# Altium project master.PrjPcb (part 2 of 2)

## Sheet mcu1_secondary.SchDoc: foxBMS BMS-Master
size A3; DocumentNumber: 11; SheetNumber: 11; SheetTotal: 24; Author: Fraunhofer IISB foxBMS Team; REL-DATE: 2017-05-16; VERSION: 1.0.2; SheetDescription: MCU1 (Secondary)
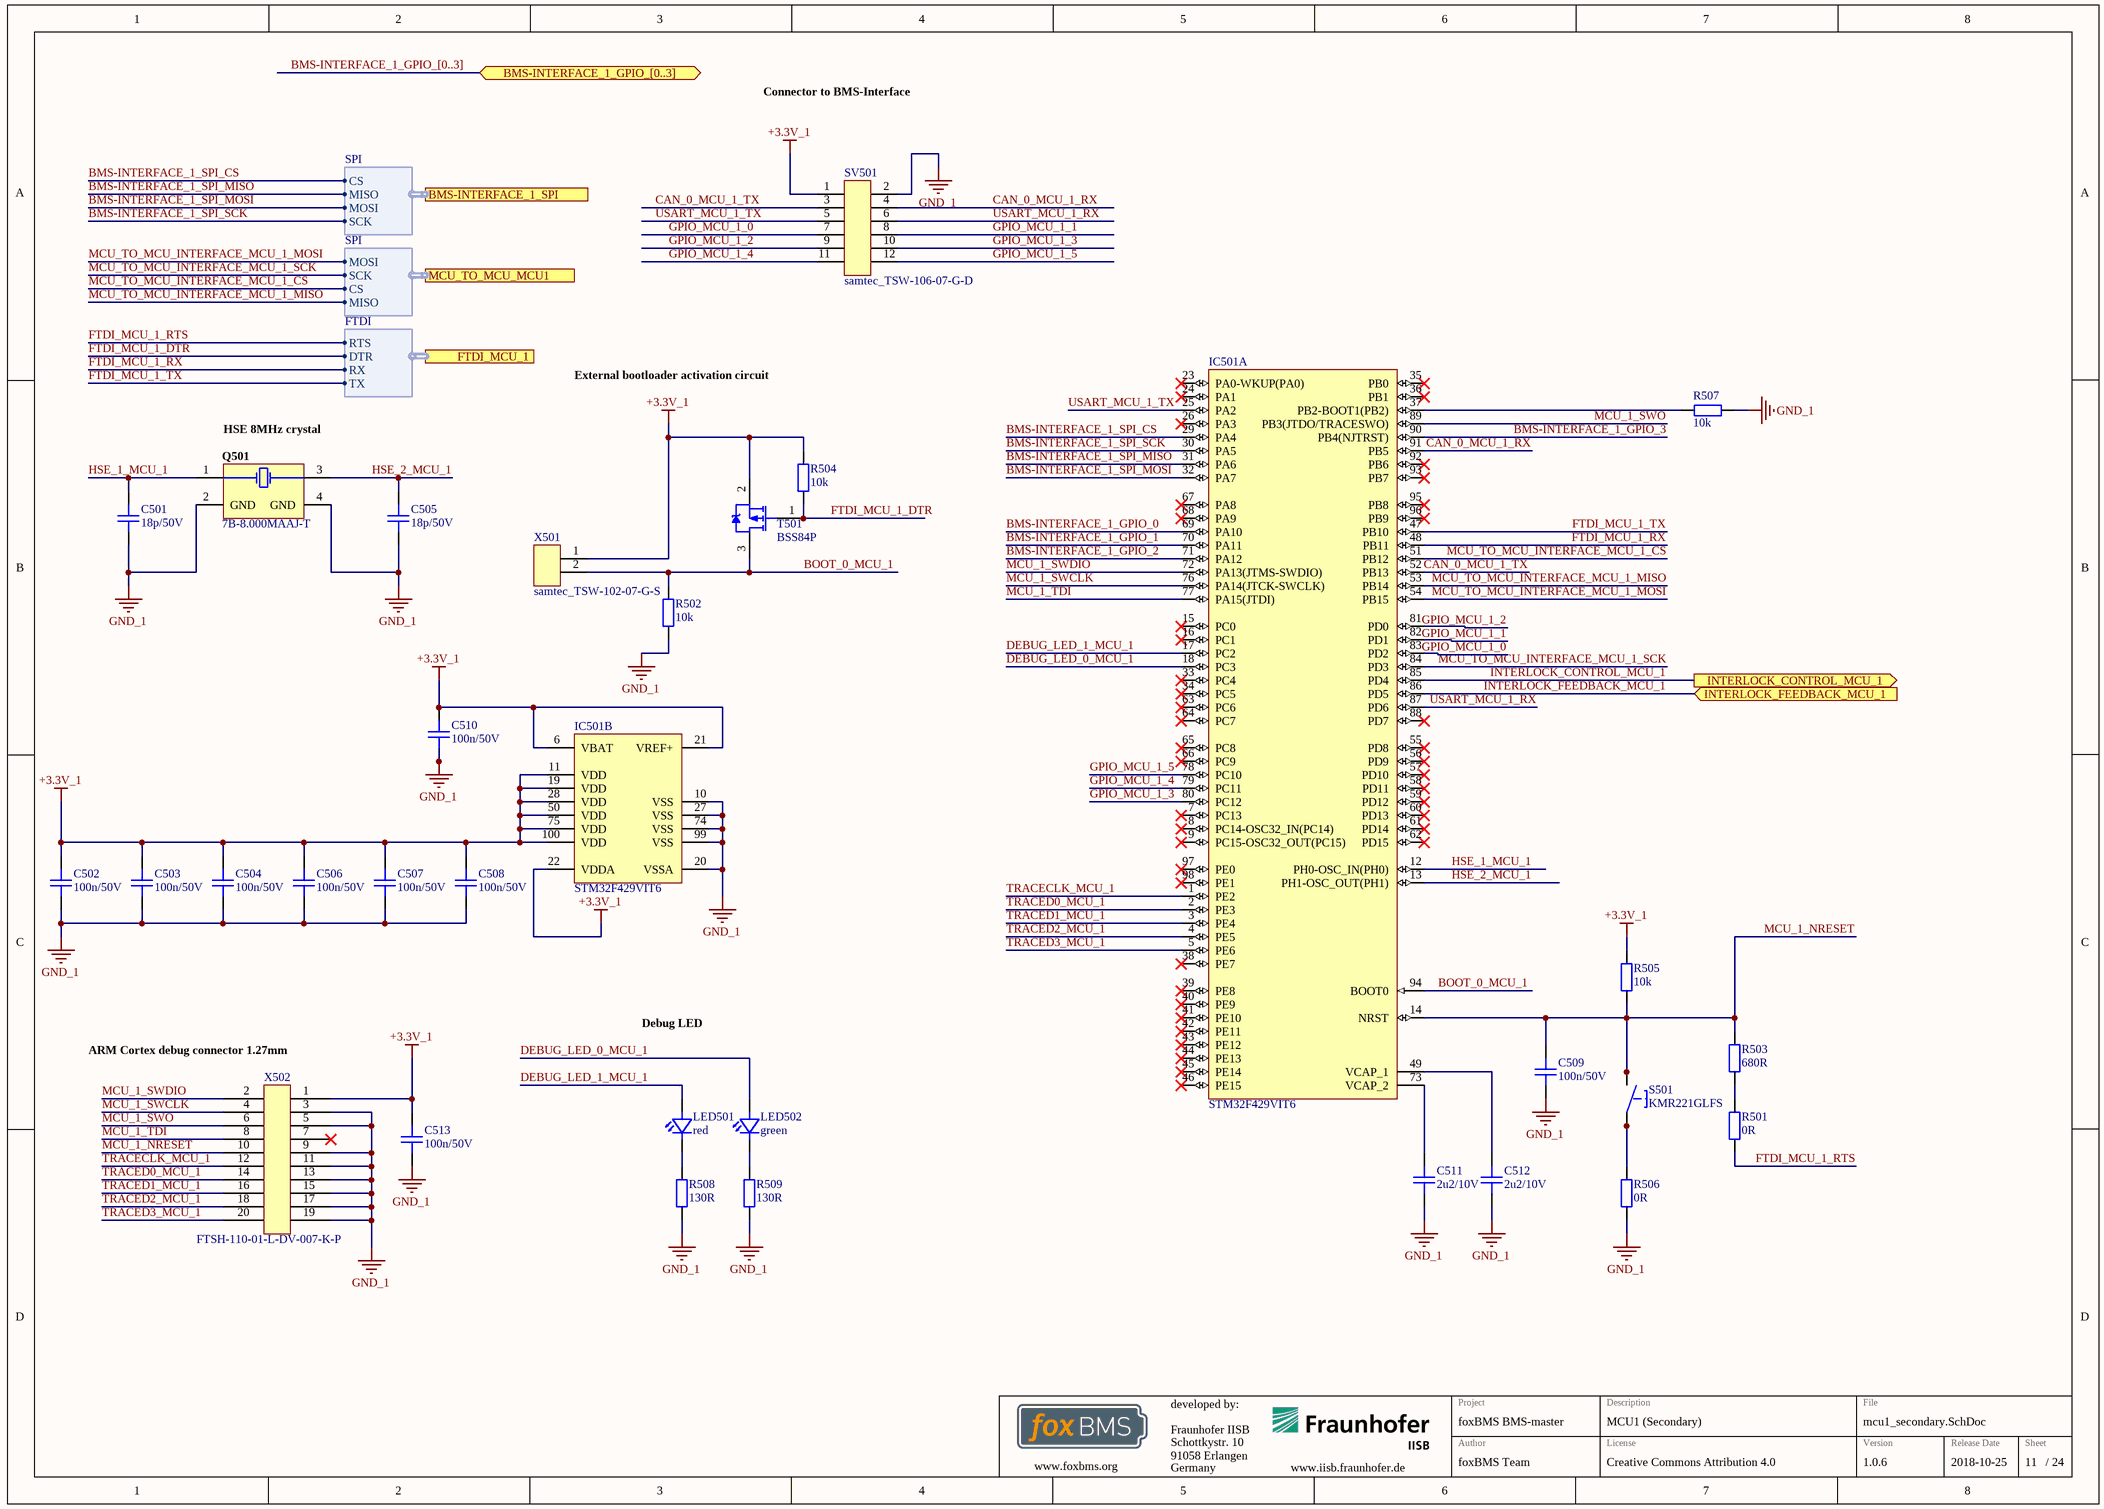
[diagram p4: mcu1_secondary.SchDoc]

### Parts
C501  18p/50V  [CAPC1608X08N]
C502  100n/50V  [CAPC1608X08N]
C503  100n/50V  [CAPC1608X08N]
C504  100n/50V  [CAPC1608X08N]
C505  18p/50V  [CAPC1608X08N]
C506  100n/50V  [CAPC1608X08N]
C507  100n/50V  [CAPC1608X08N]
C508  100n/50V  [CAPC1608X08N]
C509  100n/50V  [CAPC1608X08N]
C510  100n/50V  [CAPC1608X08N]
C511  2u2/10V  [CAPC1608X08N]
C512  2u2/10V  [CAPC1608X08N]
C513  100n/50V  [CAPC1608X08N]
IC501  STM32F429VIT6  [STM-LQFP100_N]  (parts A,B of 2)
LED501  red  [LEDC1608X07N]
LED502  green  [LEDC1608X07N]
Q501  7B-8.000MAAJ-T  [TXC-7B-4_V]
R501  0R  [RESC1608X05N]
R502  10k  [RESC1608X05N]
R503  680R  [RESC1608X05N]
R504  10k  [RESC1608X05N]
R505  10k  [RESC1608X05N]
R506  0R  [RESC1608X05N]
R507  10k  [RESC1608X05N]
R508  130R  [RESC1608X05N]
R509  130R  [RESC1608X05N]
S501  KMR221GLFS  [KMR2_Series]
SV501  samtec_TSW-106-07-G-D  [Pinheader_2.54_2x6]
T501  BSS84P  [INF-PG-SOT23_N]
X501  samtec_TSW-102-07-G-S  [Pinheader_2.54_2]
X502  FTSH-110-01-L-DV-007-K-P  [CORTEX_DEBUG_20_PIN]

### Ports
BMS-INTERFACE_1_GPIO_[0..3] (bidir), BMS-INTERFACE_1_SPI (harness SPI), FTDI_MCU_1 (harness FTDI), INTERLOCK_CONTROL_MCU_1 (out), INTERLOCK_FEEDBACK_MCU_1 (in), MCU_TO_MCU_MCU1 (harness SPI)

### Harnesses
SPI: CS, MISO, MOSI, SCK
FTDI: RTS, DTR, RX, TX

### Nets
+3.3V_1: C502.1 C503.1 C504.1 C506.1 C507.1 C508.1 C510.1 C513.1 IC501.6(VBAT) IC501.11(VDD) IC501.19(VDD) IC501.21(VREF+) IC501.22(VDDA) IC501.28(VDD) IC501.50(VDD) IC501.75(VDD) IC501.100(VDD) R504.2 R505.2 SV501.1 T501.2(SOURCE) X501.1 X502.1
GND_1: C501.1 C502.2 C503.2 C504.2 C505.2 C506.2 C507.2 C508.2 C509.2 C510.2 C511.2 C512.2 C513.2 IC501.10(VSS) IC501.20(VSSA) IC501.27(VSS) IC501.74(VSS) IC501.99(VSS) Q501.2(GND) Q501.4(GND) R502.1 R506.1 R507.1 R508.1 R509.1 SV501.2 X502.3 X502.5 X502.9 X502.11 X502.13 X502.15 X502.17 X502.19
BMS-INTERFACE_1_GPIO_0: IC501.69(PA10)
BMS-INTERFACE_1_GPIO_1: IC501.70(PA11)
BMS-INTERFACE_1_GPIO_2: IC501.71(PA12)
BMS-INTERFACE_1_GPIO_3: IC501.90(PB4(NJTRST))
BMS-INTERFACE_1_SPI_CS: IC501.29(PA4) ; port BMS-INTERFACE_1_SPI.CS
BMS-INTERFACE_1_SPI_MISO: IC501.31(PA6) ; port BMS-INTERFACE_1_SPI.MISO
BMS-INTERFACE_1_SPI_MOSI: IC501.32(PA7) ; port BMS-INTERFACE_1_SPI.MOSI
BMS-INTERFACE_1_SPI_SCK: IC501.30(PA5) ; port BMS-INTERFACE_1_SPI.SCK
BOOT_0_MCU_1: IC501.94(BOOT0) R502.2 T501.3(DRAIN) X501.2
CAN_0_MCU_1_RX: IC501.91(PB5) SV501.4
CAN_0_MCU_1_TX: IC501.52(PB13) SV501.3
DEBUG_LED_0_MCU_1: IC501.18(PC3) LED502.2(A)
DEBUG_LED_1_MCU_1: IC501.17(PC2) LED501.2(A)
FTDI_MCU_1_DTR: R504.1 T501.1(GATE) ; port FTDI_MCU_1.DTR
FTDI_MCU_1_RTS: R501.2 ; port FTDI_MCU_1.RTS
FTDI_MCU_1_RX: IC501.48(PB11) ; port FTDI_MCU_1.RX
FTDI_MCU_1_TX: IC501.47(PB10) ; port FTDI_MCU_1.TX
GPIO_MCU_1_0: IC501.83(PD2) SV501.7
GPIO_MCU_1_1: IC501.82(PD1) SV501.8
GPIO_MCU_1_2: IC501.81(PD0) SV501.9
GPIO_MCU_1_3: IC501.80(PC12) SV501.10
GPIO_MCU_1_4: IC501.79(PC11) SV501.11
GPIO_MCU_1_5: IC501.78(PC10) SV501.12
HSE_1_MCU_1: C501.2 IC501.12(PH0-OSC_IN(PH0)) Q501.1(X1)
HSE_2_MCU_1: C505.1 IC501.13(PH1-OSC_OUT(PH1)) Q501.3(X2)
INTERLOCK_CONTROL_MCU_1: IC501.85(PD4) ; port INTERLOCK_CONTROL_MCU_1
INTERLOCK_FEEDBACK_MCU_1: IC501.86(PD5) ; port INTERLOCK_FEEDBACK_MCU_1
MCU_1_NRESET: C509.1 IC501.14(NRST) R503.1 R505.1 S501.3 S501.4 X502.10
MCU_1_SWCLK: IC501.76(PA14(JTCK-SWCLK)) X502.4
MCU_1_SWDIO: IC501.72(PA13(JTMS-SWDIO)) X502.2
MCU_1_SWO: IC501.89(PB3(JTDO/TRACESWO)) X502.6
MCU_1_TDI: IC501.77(PA15(JTDI)) X502.8
MCU_TO_MCU_INTERFACE_MCU_1_CS: IC501.51(PB12) ; port MCU_TO_MCU_MCU1.CS
MCU_TO_MCU_INTERFACE_MCU_1_MISO: IC501.53(PB14) ; port MCU_TO_MCU_MCU1.MISO
MCU_TO_MCU_INTERFACE_MCU_1_MOSI: IC501.54(PB15) ; port MCU_TO_MCU_MCU1.MOSI
MCU_TO_MCU_INTERFACE_MCU_1_SCK: IC501.84(PD3) ; port MCU_TO_MCU_MCU1.SCK
TRACECLK_MCU_1: IC501.1(PE2) X502.12
TRACED0_MCU_1: IC501.2(PE3) X502.14
TRACED1_MCU_1: IC501.3(PE4) X502.16
TRACED2_MCU_1: IC501.4(PE5) X502.18
TRACED3_MCU_1: IC501.5(PE6) X502.20
USART_MCU_1_RX: IC501.87(PD6) SV501.6
USART_MCU_1_TX: IC501.25(PA2) SV501.5
NetC511_1: C511.1 IC501.73(VCAP_2)
NetC512_1: C512.1 IC501.49(VCAP_1)
NetIC501_37: IC501.37(PB2-BOOT1(PB2)) R507.2
NetLED501_1: LED501.1(C) R508.2
NetLED502_1: LED502.1(C) R509.2
NetR501_1: R501.1 R503.2
NetR506_2: R506.2 S501.1 S501.2

Not connected (* = marked no-connect by the designer): IC501 7(PC13)* 8(PC14-OSC32_IN(PC14))* 9(PC15-OSC32_OUT(PC15))* 15(PC0)* 16(PC1)* 23(PA0-WKUP(PA0))* 24(PA1)* 26(PA3)* 33(PC4)* 34(PC5)* 35(PB0)* 36(PB1)* 38(PE7)* 39(PE8)* 40(PE9)* 41(PE10)* 42(PE11)* 43(PE12)* 44(PE13)* 45(PE14)* 46(PE15)* 55(PD8)* 56(PD9)* 57(PD10)* 58(PD11)* 59(PD12)* 60(PD13)* 61(PD14)* 62(PD15)* 63(PC6)* 64(PC7)* 65(PC8)* 66(PC9)* 67(PA8)* 68(PA9)* 88(PD7)* 92(PB6)* 93(PB7)* 95(PB8)* 96(PB9)* 97(PE0)* 98(PE1)*; X502 7*

### Buses and harness runs
bus BMS-INTERFACE_1_GPIO_[0..3] = port BMS-INTERFACE_1_GPIO_[0..3]

### Notes on the sheet
- Connector to BMS-Interface
- External bootloader activation circuit
- (near Q501) HSE 8MHz crystal
- (near X502) ARM Cortex debug connector 1.27mm
- Debug LED
- Fraunhofer IISB
- Schottkystr. 10
- developed by:
- 91058 Erlangen
- Germany
- Author
- Project
- License
- Description
- File
- Version
- Release Date
- Sheet
- www.foxbms.org
- www.iisb.fraunhofer.de
- foxBMS Team
- /

### Library data of the parts
C501 C505 = gen_C_ceramic_18p_50V_C0G_0603: MLCC; Capacitance: 18p; Rated Voltage: 50V; Dielectric: C0G; Case EIA: 0603; Case Metric: 1608; Automotive Qualified: False; Part Number: gen_C_ceramic_18p_50V_C0G_0603; Supplier 1: Farnell; Supplier Part Number 1: 2070403
C502-C504 C506-C510 C513 = gen_C_ceramic_100n_50V_X7R_0603: MLCC; Capacitance: 100n; Rated Voltage: 50V; Dielectric: X7R; Case EIA: 0603; Case Metric: 1608; PnP Package: C_0603_10; PnP Value: 100n/50V/X7R; PnP equipped: x; Automotive Qualified: False; Part Number: gen_C_ceramic_100n_50V_X7R_0603; Supplier 1: Farnell; Supplier Part Number 1: 2525267; Supplier 2: Digikey; Supplier Part Number 2: 490-6049-1-ND
C511 C512 = gen_C_ceramic_2u2_10V_X5R_0603: MLCC; Capacitance: 2u2; Rated Voltage: 10V; Dielectric: X5R; Case EIA: 0603; Case Metric: 1608; AVT Set: x; Automotive Qualified: False; Part Number: gen_C_ceramic_2u2_10V_X5R_0603; Supplier 1: Farnell; Supplier Part Number 1: 2320817
IC501 = CMP-0243-00030-2: ARM Cortex-M4 32-bit MCU+FPU, 225 DMIPS, 2048 kB Flash, 256 kB Internal RAM, 82 I/Os, 100-pin LQFP, -40 to 85 degC, Tray; Manufacturer: STMicroelectronics; FLASH Size (Prog) (kB): 2048; Supply Voltage(Vcc) min (V): 1.8; Operating Frequency(F) (Processor speed) (MHz): 180; Supply Voltage(Vcc) max (V): 3.6; D/A Converter: 2x12-bit; Internal RAM Size (kB): 256; I/Os (High Current): 82; Mounting Technology: Surface Mount; ComponentLink3URL: http://www.st.com/st-web-ui/static/active/en/resource/technical/document/data_brief/DM00071938.pdf; ComponentLink2URL: http://www.st.com/st-web-ui/static/active/en/resource/technical/document/data_brief/DM00053488.pdf; ComponentLink3Description: Package Specification; Packing: Tray; PackageDescription: 100-Pin Low Profile Quad Flat Package, 14 x 14 mm Body, 0.5 mm Pitch; PartNumber: STM32F429VIT6; ComponentLink2Description: Datasheet; ComponentLink1Description: Manufacturer URL; ComponentLink1URL: http://www.st.com/web/en/home.html; DatasheetVersion: Rev. 2; Core: ARM Cortex-M4; PackageReference: LQFP100; PackageVersion: Rev. 1, 06/2013
LED501 = gen_LED_0603_red: LED; Breakdown Voltage: 5V; Continuous Forward Current: 20mA; Forward Voltage @ 20mA: 2V; Automotive Qualified: False; Part Number: gen_LED_0603_red; Color: red; PnP Package: LED_0603; Supplier 1: Farnell; Supplier Part Number 1: 2099221
LED502 = gen_LED_0603_green: LED; Breakdown Voltage: 5V; Continuous Forward Current: 20mA; Forward Voltage @ 20mA: 2.2V; Automotive Qualified: False; Part Number: gen_LED_0603_green; Color: green; PnP Package: LED_0603; Supplier 1: Farnell; Supplier Part Number 1: 2099223
Q501 = CMP-1774-00004-1: SMD Seam Sealing Crystal, 8 MHz, +/- 30 ppm, 18 pF, -10 to 70 degC, 4-Pin SMD, RoHS, Tape and Reel; Power Rating: 100 mW; Case\Package: 0603; Voltage Rating: 50 V; Tolerance: 1%; Resistance: 150 Ohm; Package Quantity: 5000; Case Code (Metric): 1608; Packaging: Tape and Reel; Length: 1.6 mm; RoHSCompliant: true; REACH SVHC: No SVHC; Mount: Surface Mount; Case Code (Imperial): 0603; Pins: 2; Width: 0.8 mm; PackageDescription: 4-Pin Surface Mount Device, Body 5 x 3.2 mm, Pitch 3.7 mm; ComponentLink1Description: Datasheet; DatasheetVersion: Jul-15; ComponentLink1URL: http://www.txccorp.com/download/products/quartz_crystals/2015TXC_7B_19.pdf; PackageReference: 7B-4; Height: 0.45 mm; Max Operating Temperature: 155 degC; Min Operating Temperature: -55 degC; Voltage Rating (DC): 50 V
R501 R506 = gen_R_0R_0603: SMD Resistor 0R 0603; Power: 0.1W; Case EIA: 0603; Case Metric: 1608; PnP Package: R_0603; Maximum Working Voltage: 75V; Automotive Qualified: False; Part Number: gen_R_0R_0603; Operating Temperature: -55°C - +155°C; Resistance: 0R; Series: Jumper; PnP Value: 0R; Supplier 1: Farnell; Supplier Part Number 1: 2073345
R502 R504 R505 R507 = gen_R_10k_0603: SMD Resistor 10k 0603; Tolerance: 1%; Power: 0.1W; Case EIA: 0603; Case Metric: 1608; Maximum Working Voltage: 75V; PnP Package: R_0603; Automotive Qualified: False; Part Number: gen_R_10k_0603; Operating Temperature: -55°C - +155°C; Resistance: 10k; Series: E24, E96; PnP Value: 10k; Supplier 1: Farnell; Supplier Part Number 1: 2073349
R503 = gen_R_680R_0603: SMD Resistor 680R 0603; Tolerance: 1%; Power: 0.1W; Case EIA: 0603; Case Metric: 1608; Maximum Working Voltage: 75V; PnP Package: R_0603; Automotive Qualified: False; Part Number: gen_R_680R_0603; Operating Temperature: -55°C - +155°C; Resistance: 680R; Series: E24; PnP Value: 680R; Supplier 1: Farnell; Supplier Part Number 1: 2797303
R508 R509 = gen_R_130R_0603: SMD Resistor 130R 0603; Tolerance: 1%; Power: 0.1W; Case EIA: 0603; Case Metric: 1608; Maximum Working Voltage: 75V; PnP Package: R_0603; Automotive Qualified: False; Part Number: gen_R_130R_0603; Operating Temperature: -55°C - +155°C; Resistance: 130R; Series: E24, E96; PnP Value: 130R; Supplier 1: Farnell; Supplier Part Number 1: 2379959
S501 = KMR221GLFS: Microminiature Tactile Switch; Manufacturer: CK Components; Automotive Qualified: False; Part Number: KMR221GLFS; Operating Temperature: -40°C - +85°C; ComponentLink1Description: Datasheet; ComponentLink1URL: http://www.farnell.com/datasheets/1685525.pdf; Supplier 1: Farnell; Supplier Part Number 1: 1201424; Supplier 2: Digikey; Supplier Part Number 2: 401-1426-1-ND; Supplier 3: Mouser; Supplier Part Number 3: 611-KMR211G-LFS
SV501 = samtec_TSW-106-07-G-D: Board-To-Board Connector, Vertical, 2.54 mm, 12 Contacts, Header, TSW Series, Through Hole, 2 Rows; Manufacturer: Samtec; Circuits: 12; Rated Voltage: 500V AC mated with SSW; Automotive Qualified: False; Part Number: samtec_TSW-106-07-G-D; Part Name: TSW-106-07-G-D; Operating Temperature: -55°C - +125°C; ComponentLink1Description: Datasheet; ComponentLink1URL: http://www.farnell.com/datasheets/1992055.pdf?_ga=2.196729640.569325269.1503285096-1413671594.1503025027; Supplier 1: Farnell; Supplier Part Number 1: 2025252
T501 = CMP-1099-00028-1: P-Channel SIPMOS Small-Signal-Transistor, -60 V VDS, -0.17 A ID, -55 to 150 degC, PG-SOT23, Reel, Green; Manufacturer: Infineon; VGS(th) (max): -2Â V; VGS(th) (min): -1Â V; VDS (max): -60Â V; Rth: 350Â K/W; Pto t (max): 0.36Â W; ID (max): -0.17Â A; IDpuls (max): -0.68Â A; RDS (on) (max) (@4.5V): 12,000Â mOhm; QG: 1Â nC; Green: TRUE; RDS (on) (max): 8,000Â mOhm; ComponentLink3URL: http://www.infineon.com/dgdl/SOT23-Package_Overview.pdf?folderId=db3a30431936bc4b0119532290053c66&fileId=db3a30431936bc4b0119533468123c85; ComponentLink3Description: Package Specification; Packing: Reel; PartNumber: BSS84P; ComponentLink2Description: Datasheet; Mounting Technology: Surface Mount; ComponentLink2URL: http://www.infineon.com/dgdl/BSS84P_Rev2.7%5B1%5D.pdf?folderId=db3a304314dca38901154a72e3951a65&fileId=db3a304330f68606013118ac7a9b4549; PackageReference: PG-SOT23; ComponentLink1URL: http://www.infineon.com/; PackageVersion: Apr-08; ComponentLink1Description: Manufacturer URL; PackageDescription: 3-Pin Small Outline Transistor Package, 2.9 x 1.3 mm Body, 0.95 mm Pitch; Halogen-free: TRUE; DatasheetVersion: Rev. 2.7
X501 = samtec_TSW-102-07-G-S: Board-To-Board Connector, Vertical, 2.54 mm, 2 Contacts, Header, TSW Series, Through Hole, 1 Row; Manufacturer: Samtec; Circuits: 2; Automotive Qualified: False; Part Number: samtec_TSW-102-07-G-S; Part Name: TSW-102-07-G-S; Operating Temperature: -55°C - +125°C; ComponentLink1Description: Datasheet; ComponentLink1URL: http://www.farnell.com/datasheets/1796313.pdf; Supplier 1: Farnell; Supplier Part Number 1: 2505044
X502 = samtec_FTSH-110-01-L-DV-007-K-P: Board-To-Board Connector, ARM Cortex Debug Header 20 Pin; Manufacturer: Samtec; Circuits: 20; Automotive Qualified: False; Part Number: samtec_FTSH-110-01-L-DV-007-K-P; Part Name: FTSH-110-01-L-DV-007-K-P; Operating Temperature: -55°C - +125°C; Supplier 1: Digikey; Supplier Part Number 1: SAM11268-ND; Supplier 2: Avnet; Supplier Part Number 2: FTSH-110-01-L-DV-007-K-P

## Sheet contactor_control.SchDoc: foxBMS BMS-Master
size A3; DocumentNumber: 16; SheetNumber: 16; SheetTotal: 24; Author: Fraunhofer IISB foxBMS Team; REL-DATE: 2017-05-16; VERSION: 1.0.2; SheetDescription: Contactor Control
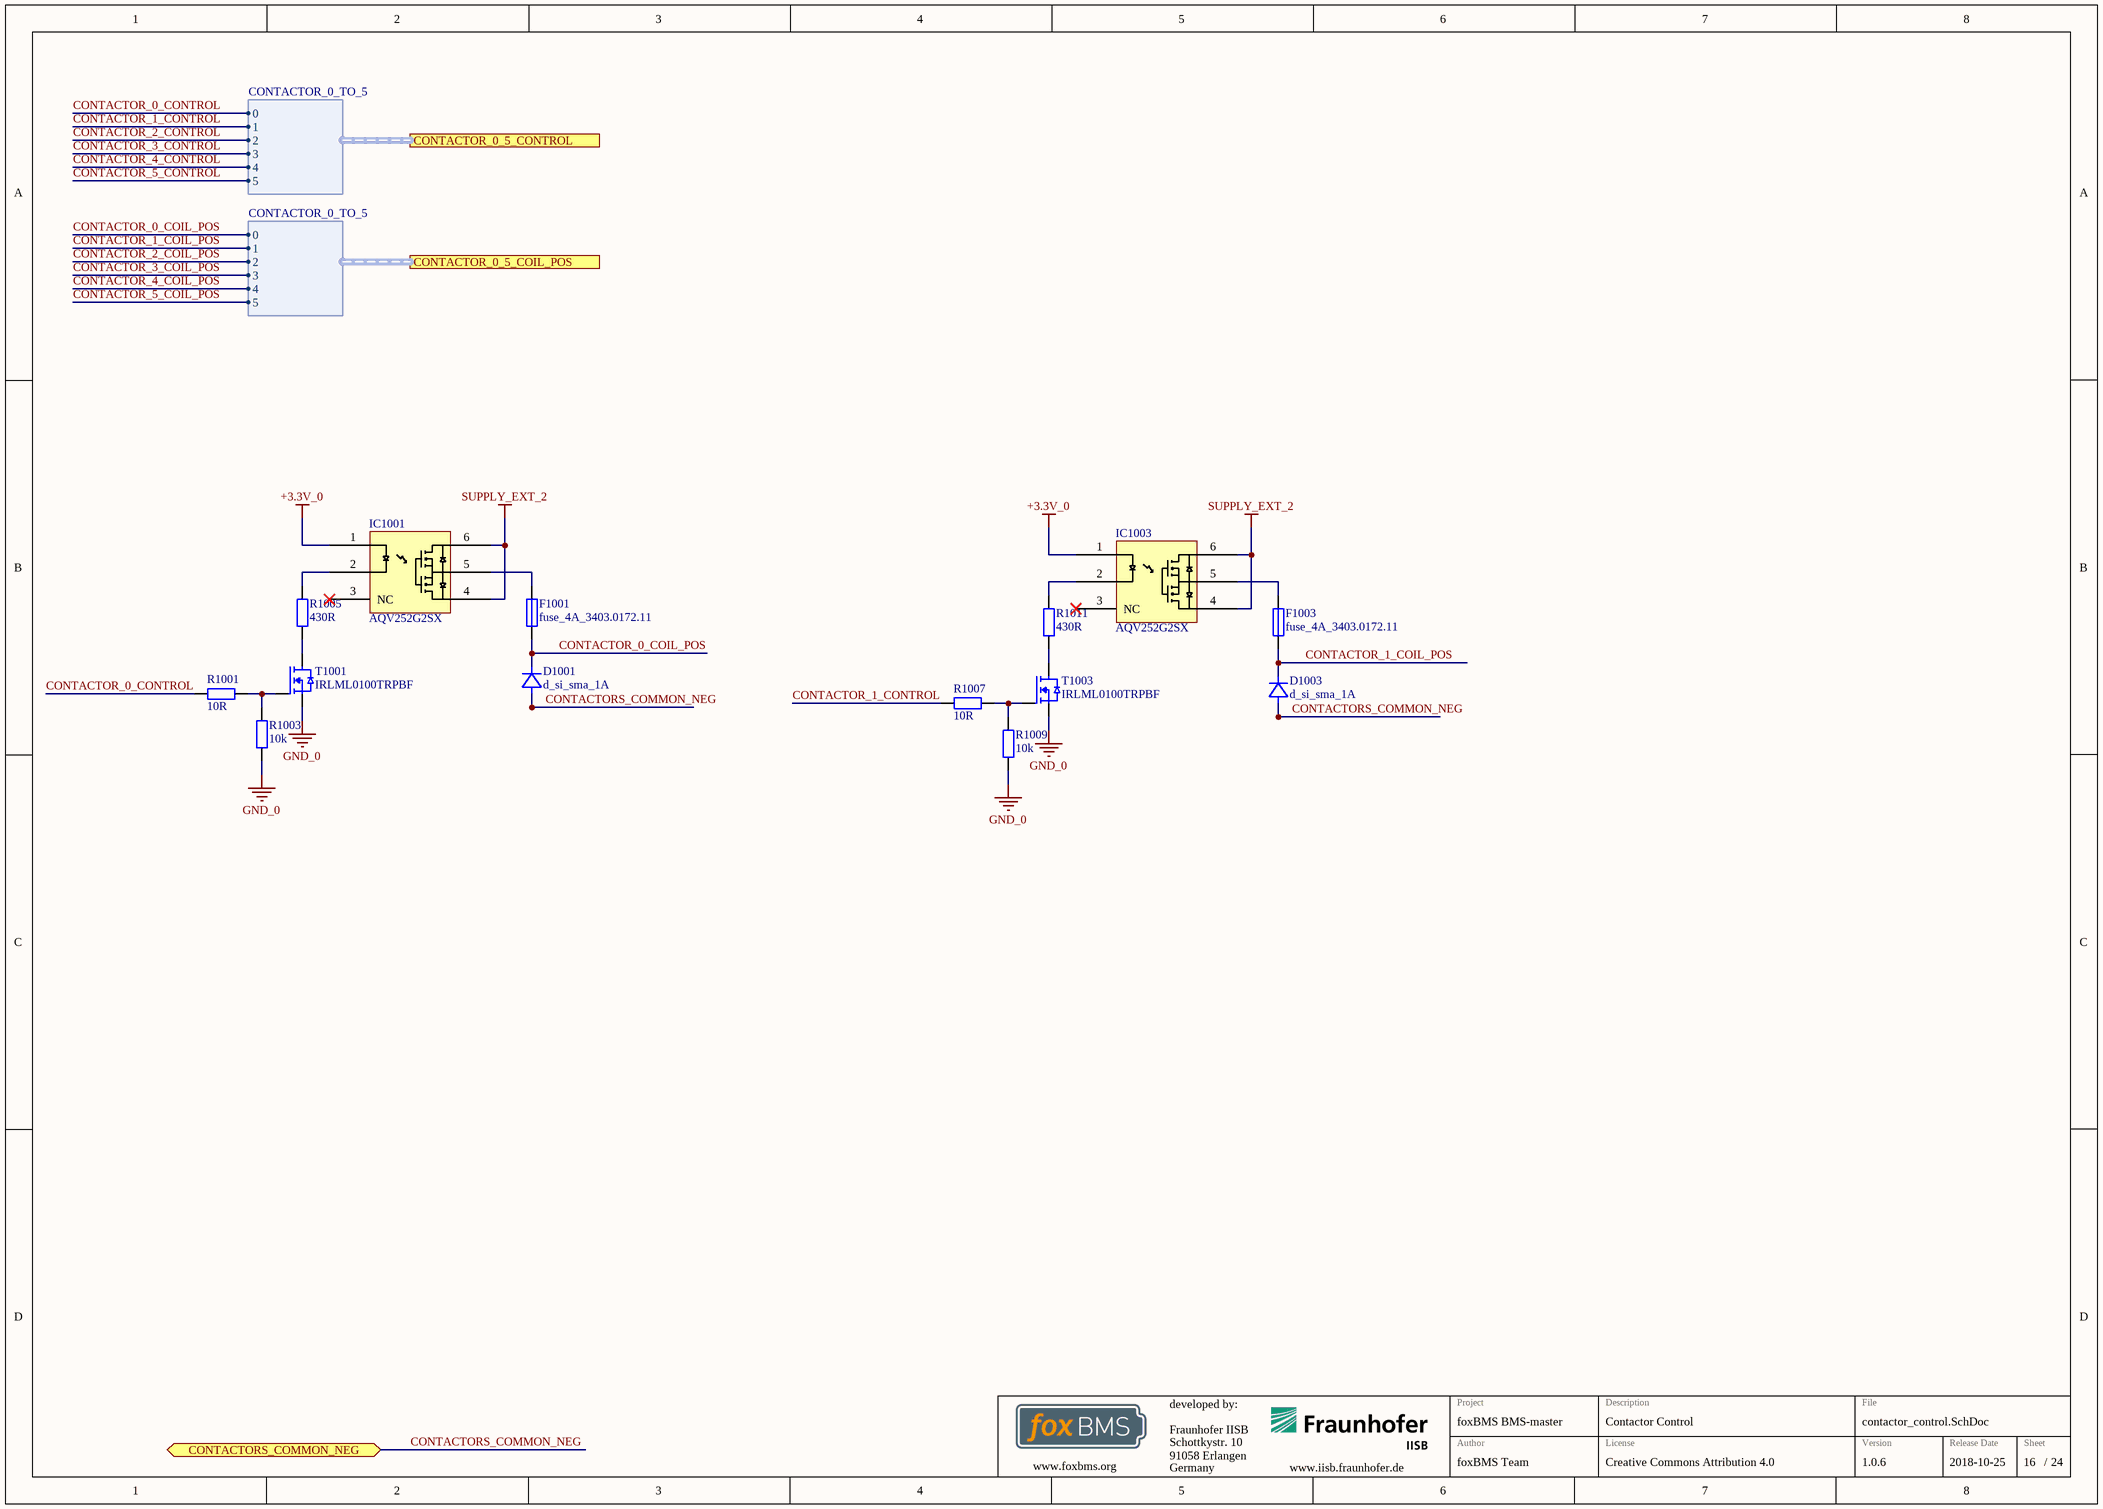
[diagram p5: contactor_control.SchDoc]

### Parts
D1001  d_si_sma_1A  [DIOM4326X24N]
D1003  d_si_sma_1A  [DIOM4326X24N]
F1001  fuse_4A_3403.0172.11  [Schurter_UMT_250]
F1003  fuse_4A_3403.0172.11  [Schurter_UMT_250]
IC1001  AQV252G2SX  [SOP254P680X220-6N]
IC1003  AQV252G2SX  [SOP254P680X220-6N]
R1001  10R  [RESC1608X05N]
R1003  10k  [RESC1608X05N]
R1005  430R  [RESC1608X05N]
R1007  10R  [RESC1608X05N]
R1009  10k  [RESC1608X05N]
R1011  430R  [RESC1608X05N]
T1001  IRLML0100TRPBF  [SOT95P237X110-3N]
T1003  IRLML0100TRPBF  [SOT95P237X110-3N]

### Ports
CONTACTOR_0_5_COIL_POS (harness CONTACTOR_0_TO_5), CONTACTOR_0_5_CONTROL (harness CONTACTOR_0_TO_5), CONTACTORS_COMMON_NEG (bidir)

### Harnesses
CONTACTOR_0_TO_5: 0, 1, 2, 3, 4, 5

### Nets
+3.3V_0: IC1001.1 IC1003.1
GND_0: R1003.1 R1009.1 T1001.S T1003.S
SUPPLY_EXT_2: IC1001.4 IC1001.6 IC1003.4 IC1003.6
CONTACTOR_0_COIL_POS: D1001.1(K) F1001.2 ; port CONTACTOR_0_5_COIL_POS.0
CONTACTOR_0_CONTROL: R1001.2 ; port CONTACTOR_0_5_CONTROL.0
CONTACTOR_1_COIL_POS: D1003.1(K) F1003.2 ; port CONTACTOR_0_5_COIL_POS.1
CONTACTOR_1_CONTROL: R1007.2 ; port CONTACTOR_0_5_CONTROL.1
CONTACTOR_2_COIL_POS: port CONTACTOR_0_5_COIL_POS.2
CONTACTOR_3_COIL_POS: port CONTACTOR_0_5_COIL_POS.3
CONTACTOR_4_COIL_POS: port CONTACTOR_0_5_COIL_POS.4
CONTACTOR_4_CONTROL: port CONTACTOR_0_5_CONTROL.4
CONTACTOR_5_COIL_POS: port CONTACTOR_0_5_COIL_POS.5
CONTACTORS_COMMON_NEG: D1001.2(A) D1003.2(A) ; port CONTACTORS_COMMON_NEG
NetF1001_1: F1001.1 IC1001.5
NetF1003_1: F1003.1 IC1003.5
NetIC1001_2: IC1001.2 R1005.2
NetIC1003_2: IC1003.2 R1011.2
NetR1001_1: R1001.1 R1003.2 T1001.G
NetR1005_1: R1005.1 T1001.D
NetR1007_1: R1007.1 R1009.2 T1003.G
NetR1011_1: R1011.1 T1003.D

Not connected (* = marked no-connect by the designer): IC1001 3(NC)*; IC1003 3(NC)*

### Notes on the sheet
- Fraunhofer IISB
- Schottkystr. 10
- developed by:
- 91058 Erlangen
- Germany
- Author
- Project
- License
- Description
- File
- Version
- Release Date
- Sheet
- www.foxbms.org
- www.iisb.fraunhofer.de
- foxBMS Team
- /

### Library data of the parts
D1001 D1003 = d_si_sma_1A: Standard Recovery Diode, 100 V, 1 A, Single, 1 V, 2 µs, 30 A; Part Name: GF1B; Manufacturer: ON Semiconductor; Breakdown Voltage: 100V; Continuous Forward Current: 1A; Automotive Qualified: False; Part Number: d_si_sma_1A; Operating Temperature: -65°C - +175°C; ComponentLink1Description: Datasheet; ComponentLink1URL: http://www.farnell.com/datasheets/2303965.pdf; Supplier 1: Farnell; Supplier Part Number 1: 1467477
F1001 F1003 = fuse_4A_3403.0172.11: Schurter SMD Fuse 4.0A UMT 3403.0172.11; Automotive Qualified: False; Part Number: fuse_4A_3403.0172.11; Manufacturer: Schurter; Operating Temperature: -55°C - +125°C; ComponentLink1Description: Catalog Page Digikey; ComponentLink1URL: http://dkc3.digikey.com/PDF/DE2011-DE/P2352.pdf; Supplier 1: Digikey; Supplier Part Number 1: 486-1253-ND; Supplier 2: Mouser; Supplier Part Number 2: 693-3403.0172.11
IC1001 IC1003 = AQV252G2SX: PhotoMOS Relay; Manufacturer: Panasonic; Automotive Qualified: False; Part Number: AQV252G2SX; Part Name: AQV252G2SX; Operating Temperature: -40°C - +85°C; Supplier 1: Digikey; Supplier Part Number 1: 255-3594-1-ND; Supplier 2: Farnell; Supplier Part Number 2: 2302216
R1001 R1007 = gen_R_10R_0603: SMD Resistor 10R 0603; Tolerance: 1%; Power: 0.1W; Case EIA: 0603; Case Metric: 1608; Maximum Working Voltage: 75V; PnP Package: R_0603; Automotive Qualified: False; Part Number: gen_R_10R_0603; Operating Temperature: -55°C - +155°C; Resistance: 10R; Series: E24, E96; PnP Value: 10R; Supplier 1: Farnell; Supplier Part Number 1: 2073361
R1003 R1009 = gen_R_10k_0603: as R502 on sheet mcu1_secondary; Part Number: gen_R_10k_0603; Operating Temperature: -55°C - +155°C; Resistance: 10k; Series: E24, E96; PnP Value: 10k; Supplier 1: Farnell; Supplier Part Number 1: 2073349
R1005 R1011 = gen_R_430R_0603: SMD Resistor 430R 0603; Tolerance: 1%; Power: 0.1W; Case EIA: 0603; Case Metric: 1608; Maximum Working Voltage: 75V; PnP Package: R_0603; Automotive Qualified: False; Part Number: gen_R_430R_0603; Operating Temperature: -55°C - +155°C; Resistance: 430R; Series: E24; PnP Value: 430R; Supplier 1: Farnell; Supplier Part Number 1: 2074259
T1001 T1003 = IRLML0100TRPBF: MOSFET-Transistor, n-Kanal, 1.6 A, 100 V, 0.178 ohm, 10 V, 2.5 V; Manufacturer: Infineon; Maximum Drain-Source Voltage: 100V; Maximum Continous Drain Current (25°C): 1.6A; R_DS(on): 190m; Total Gate Charge: 2.5nC; Automotive Qualified: False; Part Number: IRLML0100TRPBF; Part Name: NMOS; Operating Temperature: -55°C - +150°C; ComponentLink1Description: Datasheet URL; ComponentLink1URL: http://www.farnell.com/datasheets/491501.pdf; Supplier 1: Farnell; Supplier Part Number 1: 1783928

## Sheet contactor_feedback.SchDoc: foxBMS BMS-Master
size A3; DocumentNumber: 17; SheetNumber: 17; SheetTotal: 24; Author: Fraunhofer IISB foxBMS Team; REL-DATE: 2017-05-16; VERSION: 1.0.2; SheetDescription: Contactor Feedback
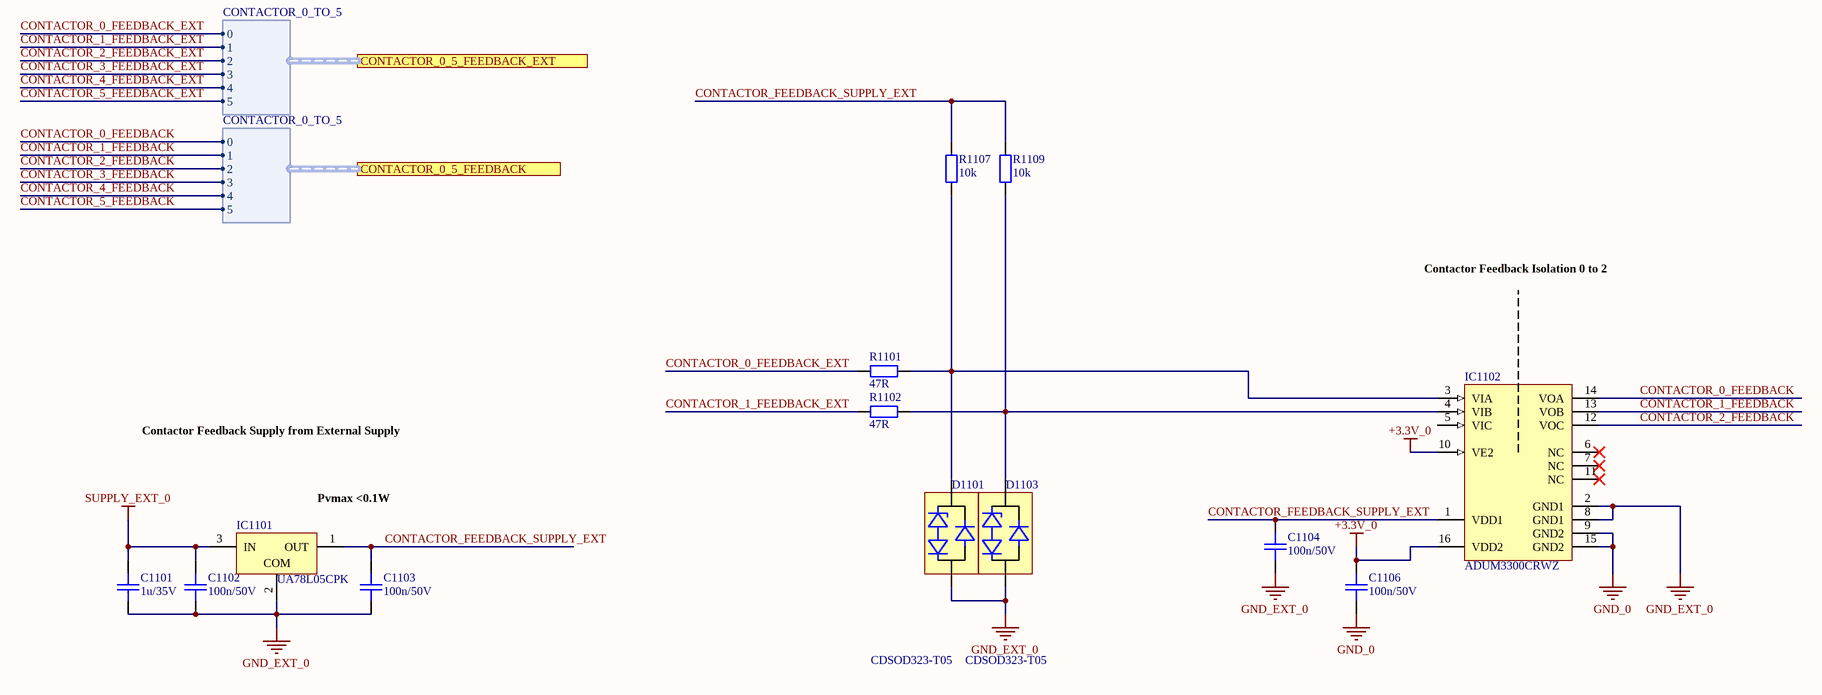
[diagram p6: contactor_feedback.SchDoc]

### Parts
C1101  1u/35V  [CAPC1608X08N]
C1102  100n/50V  [CAPC1608X08N]
C1103  100n/50V  [CAPC1608X08N]
C1104  100n/50V  [CAPC1608X08N]
C1106  100n/50V  [CAPC1608X08N]
D1101  CDSOD323-T05  [SODFL250X110-2N]
D1103  CDSOD323-T05  [SODFL250X110-2N]
IC1101  UA78L05CPK  [PK0003A_L]
IC1102  ADUM3300CRWZ  [ADI-RW-16_L]
R1101  47R  [RESC1608X05N]
R1102  47R  [RESC1608X05N]
R1107  10k  [RESC1608X05N]
R1109  10k  [RESC1608X05N]

### Ports
CONTACTOR_0_5_FEEDBACK (harness CONTACTOR_0_TO_5), CONTACTOR_0_5_FEEDBACK_EXT (harness CONTACTOR_0_TO_5)

### Harnesses
CONTACTOR_0_TO_5: 0, 1, 2, 3, 4, 5

### Nets
+3.3V_0: C1106.1 IC1102.10(VE2) IC1102.16(VDD2)
GND_0: C1106.2 IC1102.9(GND2) IC1102.15(GND2)
GND_EXT_0: C1101.2 C1102.2 C1103.2 C1104.2 D1101.2(A) D1103.2(A) IC1101.2(COM) IC1102.2(GND1) IC1102.8(GND1)
SUPPLY_EXT_0: C1101.1 C1102.1 IC1101.3(IN)
CONTACTOR_0_FEEDBACK: IC1102.14(VOA) ; port CONTACTOR_0_5_FEEDBACK.0
CONTACTOR_0_FEEDBACK_EXT: R1101.1 ; port CONTACTOR_0_5_FEEDBACK_EXT.0
CONTACTOR_1_FEEDBACK: IC1102.13(VOB) ; port CONTACTOR_0_5_FEEDBACK.1
CONTACTOR_1_FEEDBACK_EXT: R1102.1 ; port CONTACTOR_0_5_FEEDBACK_EXT.1
CONTACTOR_2_FEEDBACK: IC1102.12(VOC) ; port CONTACTOR_0_5_FEEDBACK.2
CONTACTOR_2_FEEDBACK_EXT: port CONTACTOR_0_5_FEEDBACK_EXT.2
CONTACTOR_3_FEEDBACK_EXT: port CONTACTOR_0_5_FEEDBACK_EXT.3
CONTACTOR_4_FEEDBACK_EXT: port CONTACTOR_0_5_FEEDBACK_EXT.4
CONTACTOR_5_FEEDBACK_EXT: port CONTACTOR_0_5_FEEDBACK_EXT.5
CONTACTOR_FEEDBACK_SUPPLY_EXT: C1103.1 C1104.1 IC1101.1(OUT) IC1102.1(VDD1) R1107.2 R1109.2
NetD1101_1: D1101.1(K) IC1102.3(VIA) R1101.2 R1107.1
NetD1103_1: D1103.1(K) IC1102.4(VIB) R1102.2 R1109.1

Not connected (* = marked no-connect by the designer): IC1102 5(VIC) 6(NC)* 7(NC)* 11(NC)*

### Notes on the sheet
- Contactor Feedback Isolation 0 to 2
- Contactor Feedback Supply from External Supply
- (near IC1101) Pvmax <0.1W
- Fraunhofer IISB
- Schottkystr. 10
- developed by:
- 91058 Erlangen
- Germany
- Author
- Project
- License
- Description
- File
- Version
- Release Date
- Sheet
- www.foxbms.org
- www.iisb.fraunhofer.de
- foxBMS Team
- /

### Library data of the parts
C1101 = gen_C_ceramic_1u_35V_X7R_0603: MLCC; Capacitance: 1u; Rated Voltage: 35V; Dielectric: X7R; Case EIA: 0603; Case Metric: 1608; PnP Package: C_0603_10; PnP Value: 1uF/35V/X7R; PnP equipped: x; Automotive Qualified: False; Part Number: gen_C_ceramic_1u_35V_X7R_0603; Supplier 1: Farnell; Supplier Part Number 1: 1907508
C1102-C1104 C1106 = gen_C_ceramic_100n_50V_X7R_0603: as C502 on sheet mcu1_secondary; Part Number: gen_C_ceramic_100n_50V_X7R_0603; Supplier 1: Farnell; Supplier Part Number 1: 2525267; Supplier 2: Digikey; Supplier Part Number 2: 490-6049-1-ND
D1101 D1103 = CDSOD323-T05: TVS Diode, CDSOD323 Series, Unidirectional, 5 V, 18.3 V, SOD-323, 2 Pins; Manufacturer: Bourns; Breakdown Voltage: 6V; Automotive Qualified: False; Part Number: CDSOD323-T05; Part Name: CDSOD323-T05; Operating Temperature: -55°C - +150°C; ComponentLink1Description: Datasheet; ComponentLink1URL: http://www.farnell.com/datasheets/1845299.pdf; Supplier 1: Farnell; Supplier Part Number 1: 2341914
IC1101 = CMP-2000-07341-1: Positive-Voltage Regulator, 100 mA, 0 to 125 degC, 3-Pin SOT-89 (PK), Green (RoHS & no Sb/Br), Tape and Reel; Manufacturer: TexasInstruments; Load Regulation: 60mV; Input Voltage MIN: 7V; Number of Outputs: 1; Input Voltage MAX: 20V; Output Type: Fixed; Output Current: 100mA; Output Voltage: 5V; PSRR / Ripple Rejection - Typ: 49dB; Line Regulation: 200mV; Mounting Style: SMD/SMT; Datasheet Version: Rev. U, 05/2011; Polarity: Positive; Minimum Operating Temperature: 0C; Package Reference: PK0003A; Brand: TexasInstruments; Packaging: Reel; Product Category: LinearVoltageRegulators; RoHS: True; Datasheet URL: http://www.ti.com/lit/ds/symlink/ua78l05.pdf; Package URL: http://www.ti.com/lit/ml/mhsi001b/mhsi001b.pdf; Series: UA78L05; Manufacturer URL: http://www.ti.com/; Package Description: 3-Pin Small Outline Transistor, Body 4.5 x 2.5 mm, Pitch 1.5 mm; Mounting Technology: SurfaceMount; Package / Case: SOT-89-4; Maximum Operating Temperature: +125C
IC1102 = CMP-0534-00476-1: Triple Channel Digital Isolator, Enhanced System-Level ESD Reliability, 2.5 KV rms Insulation Rating, 90 Mbps Data Rate, 32 ns Delay, Industrial, 16-pin SOIC (RW-16), Tube; Manufacturer: Analog Devices; Max Data Rate: 90Mbps; Insulation Rating (kVrms): 2.5; Max Operating Temp (degreesC): 105; ComponentLink3Description: Package Specification; ComponentLink4URL: Product URL:http://www.analog.com/en/interface-isolation/digital-isolators/adum3300/products/product.html; Code_JEDEC: MS-013-AA; PackageDescription: 16-Pin Standard Small Outline Package, Body 10.3 x 7.5 mm, Pitch 1.27 mm; ComponentLink4Description: URL Link1; ComponentLink1URL: http://www.analog.com/en/index.html; ComponentLink2URL: http://www.analog.com/static/imported-files/data_sheets/ADUM3300_3301.pdf; ComponentLink2Description: Datasheet; ComponentLink1Description: Manufacturer URL; PackageVersion: 032707-B, 03/2007; PackageReference: RW-16; PartNumber: ADUM3300CRWZ; Mounting Technology: Surface Mount; ComponentLink3URL: http://www.analog.com/static/imported-files/packages/PKG_PDF/SOIC_WIDE%20%28RW%29/RW_16.pdf; DatasheetVersion: Rev. B
R1101 R1102 = gen_R_47R_0603: SMD Resistor 47R 0603; Tolerance: 1%; Power: 0.1W; Case EIA: 0603; Case Metric: 1608; Maximum Working Voltage: 75V; PnP Package: R_0603; Automotive Qualified: False; Part Number: gen_R_47R_0603; Operating Temperature: -55°C - +155°C; Resistance: 47R; Series: E24; PnP Value: 47R; Supplier 1: Farnell; Supplier Part Number 1: 2303030
R1107 R1109 = gen_R_10k_0603: as R502 on sheet mcu1_secondary; Part Number: gen_R_10k_0603; Operating Temperature: -55°C - +155°C; Resistance: 10k; Series: E24, E96; PnP Value: 10k; Supplier 1: Farnell; Supplier Part Number 1: 2073349

## Sheet contactor_connectors.SchDoc: foxBMS BMS-Master
size A3; DocumentNumber: 18; SheetNumber: 18; SheetTotal: 24; Author: Fraunhofer IISB foxBMS Team; REL-DATE: 2017-05-16; VERSION: 1.0.2; SheetDescription: Contactor Connectors
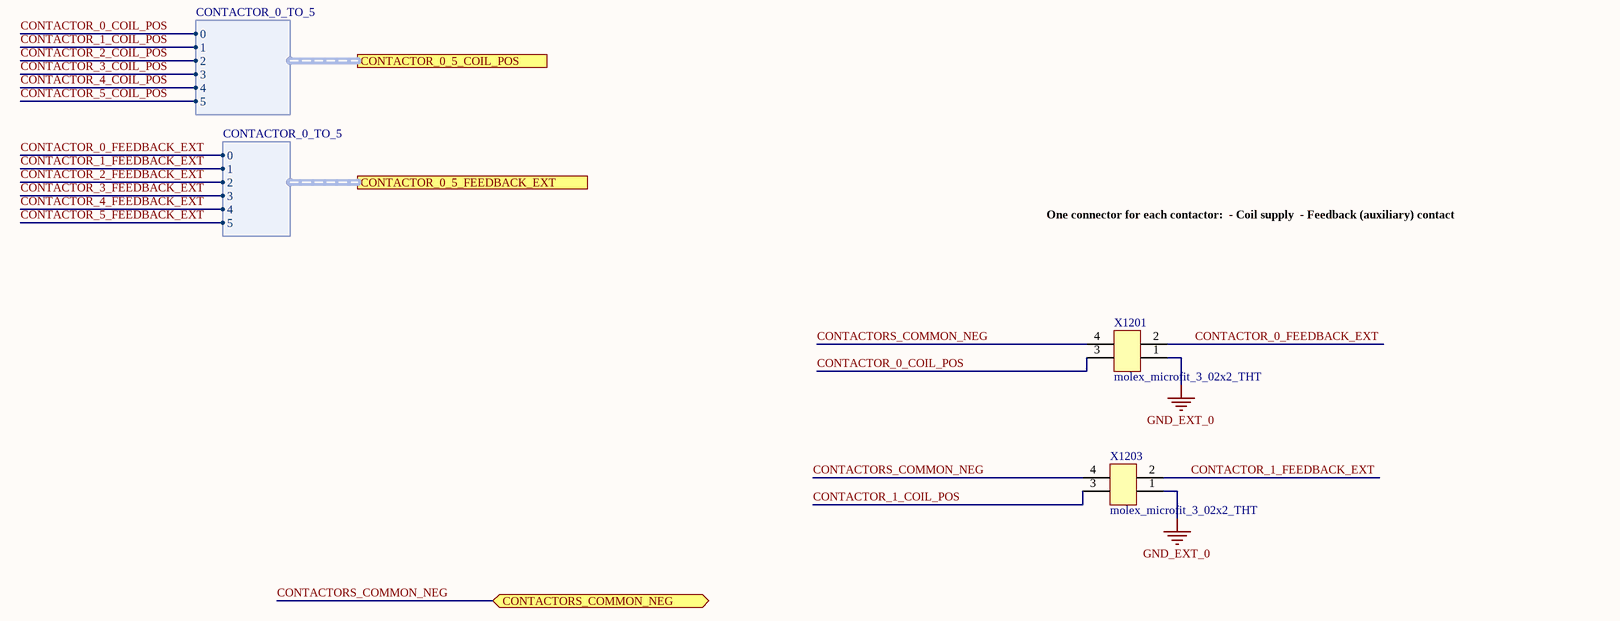
[diagram p7: contactor_connectors.SchDoc]

### Parts
X1201  molex_microfit_3_02x2_THT  [MOLEX_MICROFIT_02x2_THT]
X1203  molex_microfit_3_02x2_THT  [MOLEX_MICROFIT_02x2_THT]

### Ports
CONTACTOR_0_5_COIL_POS (harness CONTACTOR_0_TO_5), CONTACTOR_0_5_FEEDBACK_EXT (harness CONTACTOR_0_TO_5), CONTACTORS_COMMON_NEG (bidir)

### Harnesses
CONTACTOR_0_TO_5: 0, 1, 2, 3, 4, 5

### Nets
GND_EXT_0: X1201.1 X1203.1
CONTACTOR_0_COIL_POS: X1201.3 ; port CONTACTOR_0_5_COIL_POS.0
CONTACTOR_0_FEEDBACK_EXT: X1201.2 ; port CONTACTOR_0_5_FEEDBACK_EXT.0
CONTACTOR_1_COIL_POS: X1203.3 ; port CONTACTOR_0_5_COIL_POS.1
CONTACTOR_1_FEEDBACK_EXT: X1203.2 ; port CONTACTOR_0_5_FEEDBACK_EXT.1
CONTACTOR_2_COIL_POS: port CONTACTOR_0_5_COIL_POS.2
CONTACTOR_2_FEEDBACK_EXT: port CONTACTOR_0_5_FEEDBACK_EXT.2
CONTACTOR_3_COIL_POS: port CONTACTOR_0_5_COIL_POS.3
CONTACTOR_3_FEEDBACK_EXT: port CONTACTOR_0_5_FEEDBACK_EXT.3
CONTACTOR_4_COIL_POS: port CONTACTOR_0_5_COIL_POS.4
CONTACTOR_4_FEEDBACK_EXT: port CONTACTOR_0_5_FEEDBACK_EXT.4
CONTACTOR_5_COIL_POS: port CONTACTOR_0_5_COIL_POS.5
CONTACTOR_5_FEEDBACK_EXT: port CONTACTOR_0_5_FEEDBACK_EXT.5
CONTACTORS_COMMON_NEG: X1201.4 X1203.4 ; port CONTACTORS_COMMON_NEG

### Notes on the sheet
- One connector for each contactor:
  - Coil supply
  - Feedback (auxiliary) contact
- Fraunhofer IISB
- Schottkystr. 10
- developed by:
- 91058 Erlangen
- Germany
- Author
- Project
- License
- Description
- File
- Version
- Release Date
- Sheet
- www.foxbms.org
- www.iisb.fraunhofer.de
- foxBMS Team
- /

### Library data of the parts
X1201 X1203 = molex_microfit_3_02x2_THT: Micro-Fit 3.0 Right Angle Header, 3.00mm Pitch, Dual Row, 4 Circuits, with Snap-in Plastic Peg PCB Lock, Tin, Glow Wire Capable, Black, 43045-0400; Manufacturer: Molex; Circuits: 4; Rated Voltage: 600V; Rated Current: 8.5A; Automotive Qualified: False; Part Number: molex_microfit_3_02x2_THT; Part Name: MicroFit; Operating Temperature: -40°C - +105°C; Supplier 1: Farnell; Supplier Part Number 1: 9733019

## Nets that join several sheets
+3.3V_0: mcu0_primary (C430.1 IC402.171 R405.2 X403.1), bender_isometer_interface (C707.1 IC702.10 IC702.16), isolated_USB (C1405.1 IC1403.10 IC1403.16), contactor_control (IC1001.1 IC1003.1), contactor_feedback (C1106.1 IC1102.10 IC1102.16)
+3.3V_1: isolated_USB (C1410.1 IC1406.10 IC1406.16), mcu1_secondary (23 pins)
GND_0: mcu0_primary (16 pins), bender_isometer_interface (6 pins), isolated_USB (C1405.2 IC1403.9 IC1403.15), contactor_control (R1003.1 R1009.1 T1001.S T1003.S), contactor_feedback (C1106.2 IC1102.9 IC1102.15)
GND_1: isolated_USB (C1410.2 IC1406.9 IC1406.15), mcu1_secondary (34 pins)
GND_EXT_0: bender_isometer_interface (14 pins), contactor_feedback (9 pins), contactor_connectors (X1201.1 X1203.1)
SUPPLY_EXT_0: bender_isometer_interface (C701.1 C702.1 IC701.3 X701.2), contactor_feedback (C1101.1 C1102.1 IC1101.3)
BENDER_OK: mcu0_primary (IC402.46), bender_isometer_interface (IC702.14 R708.2)
BENDER_PWM: mcu0_primary (IC402.47), bender_isometer_interface (IC702.13 R709.2)
BENDER_SUPPLY_ENABLE: mcu0_primary (IC402.43), bender_isometer_interface (IC702.12 R710.2)
CONTACTOR_0_COIL_POS: contactor_control (D1001.1 F1001.2), contactor_connectors (X1201.3)
CONTACTOR_0_CONTROL: mcu0_primary (IC402.133), contactor_control (R1001.2)
CONTACTOR_0_FEEDBACK: mcu0_primary (IC402.128), contactor_feedback (IC1102.14)
CONTACTOR_0_FEEDBACK_EXT: contactor_feedback (R1101.1), contactor_connectors (X1201.2)
CONTACTOR_1_COIL_POS: contactor_control (D1003.1 F1003.2), contactor_connectors (X1203.3)
CONTACTOR_1_CONTROL: mcu0_primary (IC402.132), contactor_control (R1007.2)
CONTACTOR_1_FEEDBACK: mcu0_primary (IC402.129), contactor_feedback (IC1102.13)
CONTACTOR_1_FEEDBACK_EXT: contactor_feedback (R1102.1), contactor_connectors (X1203.2)
CONTACTORS_COMMON_NEG: contactor_control (D1001.2 D1003.2), contactor_connectors (X1201.4 X1203.4)
FTDI_MCU_0_RTS: mcu0_primary (R403.2), isolated_USB (IC1403.14)
FTDI_MCU_0_RX: mcu0_primary (IC402.80), isolated_USB (IC1403.12)
FTDI_MCU_0_TX: mcu0_primary (IC402.79), isolated_USB (IC1403.11)
FTDI_MCU_1_DTR: isolated_USB (IC1406.13), mcu1_secondary (R504.1 T501.1)
FTDI_MCU_1_RTS: isolated_USB (IC1406.14), mcu1_secondary (R501.2)
FTDI_MCU_1_RX: isolated_USB (IC1406.12), mcu1_secondary (IC501.48)
FTDI_MCU_1_TX: isolated_USB (IC1406.11), mcu1_secondary (IC501.47)

## Assembly variants
default: not fitted D1001 D1002 D1003 D1004 D1005 D1006 SV501 X902